# Altium schematic sheet main.SchDoc
size A4; Author: Daniel Olsson & David Caballero; CompanyName: ETSIT; Organization: UPM; Revision: 1.1; SheetNumber: 1; SheetTotal: 2
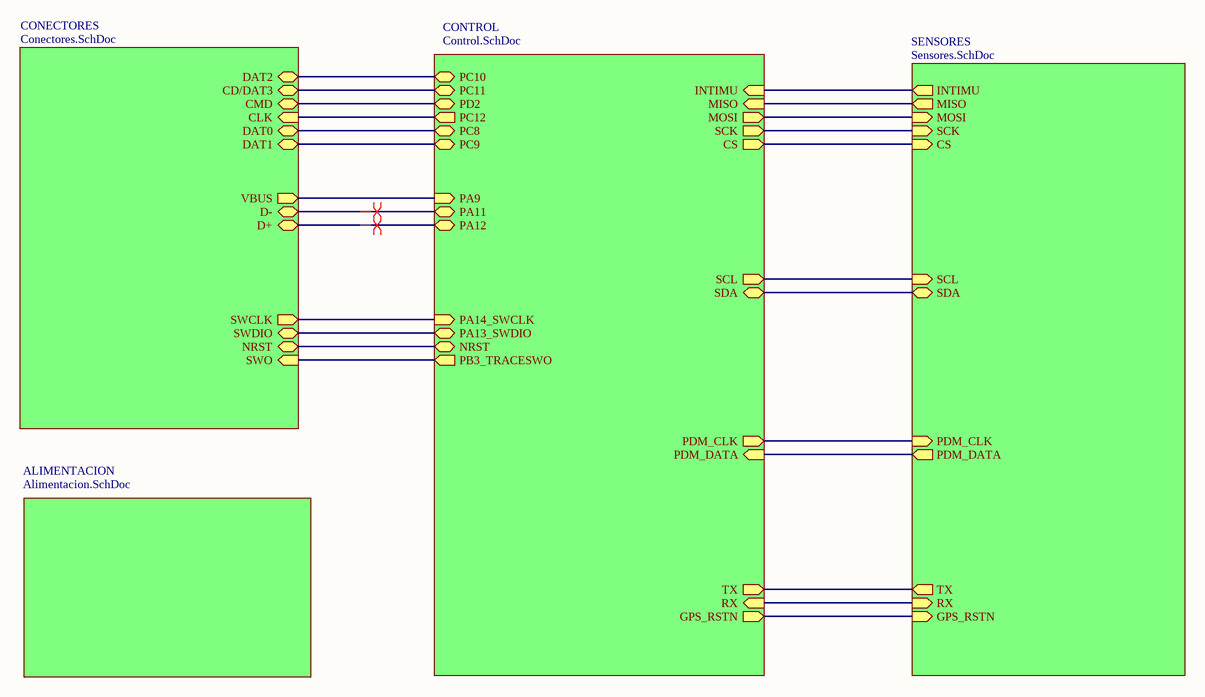
[diagram p0: main.SchDoc]

## Sub-sheets
ALIMENTACION = Alimentacion.SchDoc: no entries
CONECTORES = Conectores.SchDoc: DAT2 (bidir), CD/DAT3 (bidir), CMD (bidir), CLK (in), DAT0 (bidir), DAT1 (bidir), VBUS (out), D- (bidir), D+ (bidir), SWCLK (out), SWDIO (bidir), NRST (bidir), SWO (in)
CONTROL = Control.SchDoc: PC12 (out), PC9 (bidir), PC8 (bidir), PD2 (bidir), PC11 (bidir), PC10 (bidir), PA9 (in), PA11 (bidir), PA12 (bidir), PA14_SWCLK (in), PA13_SWDIO (bidir), NRST (bidir), PB3_TRACESWO (out), INTIMU (in), MISO (in), MOSI (out), SCK (out), CS (out), SCL (out), SDA (bidir), PDM_CLK (out), PDM_DATA (in), TX (out), RX (in), GPS_RSTN (out)
SENSORES = Sensores.SchDoc: INTIMU (out), MISO (out), MOSI (in), SCK (in), CS (in), SCL (in), SDA (bidir), PDM_CLK (in), PDM_DATA (out), TX (out), RX (in), GPS_RSTN (in)

## Nets
(unnamed): sheet CONTROL/PC12, sheet CONECTORES/CLK
(unnamed): sheet CONTROL/PC9, sheet CONECTORES/DAT1
(unnamed): sheet CONTROL/PC8, sheet CONECTORES/DAT0
(unnamed): sheet CONTROL/PD2, sheet CONECTORES/CMD
(unnamed): sheet CONTROL/PC11, sheet CONECTORES/CD/DAT3
(unnamed): sheet CONTROL/PC10, sheet CONECTORES/DAT2
(unnamed): sheet CONTROL/PA9, sheet CONECTORES/VBUS
(unnamed): sheet CONTROL/PA11, sheet CONECTORES/D-
(unnamed): sheet CONTROL/PA12, sheet CONECTORES/D+
(unnamed): sheet CONTROL/PA14_SWCLK, sheet CONECTORES/SWCLK
(unnamed): sheet CONTROL/PA13_SWDIO, sheet CONECTORES/SWDIO
(unnamed): sheet CONTROL/NRST, sheet CONECTORES/NRST
(unnamed): sheet CONTROL/PB3_TRACESWO, sheet CONECTORES/SWO
(unnamed): sheet CONTROL/INTIMU, sheet SENSORES/INTIMU
(unnamed): sheet CONTROL/MISO, sheet SENSORES/MISO
(unnamed): sheet CONTROL/MOSI, sheet SENSORES/MOSI
(unnamed): sheet CONTROL/SCK, sheet SENSORES/SCK
(unnamed): sheet CONTROL/CS, sheet SENSORES/CS
(unnamed): sheet CONTROL/SCL, sheet SENSORES/SCL
(unnamed): sheet CONTROL/SDA, sheet SENSORES/SDA
(unnamed): sheet CONTROL/PDM_CLK, sheet SENSORES/PDM_CLK
(unnamed): sheet CONTROL/PDM_DATA, sheet SENSORES/PDM_DATA
(unnamed): sheet CONTROL/TX, sheet SENSORES/TX
(unnamed): sheet CONTROL/RX, sheet SENSORES/RX
(unnamed): sheet CONTROL/GPS_RSTN, sheet SENSORES/GPS_RSTN

## Layout directives
differential pair: (no net found under the mark)

## Notes on the sheet
- Title:
- Drawn By:
- Page Contents:
- Checked By:
- Size:
- Date:
- File:
- License:
- Email:
- A4
- Number:
- Time:
- Revision:
- Sheet
- Website:
- of